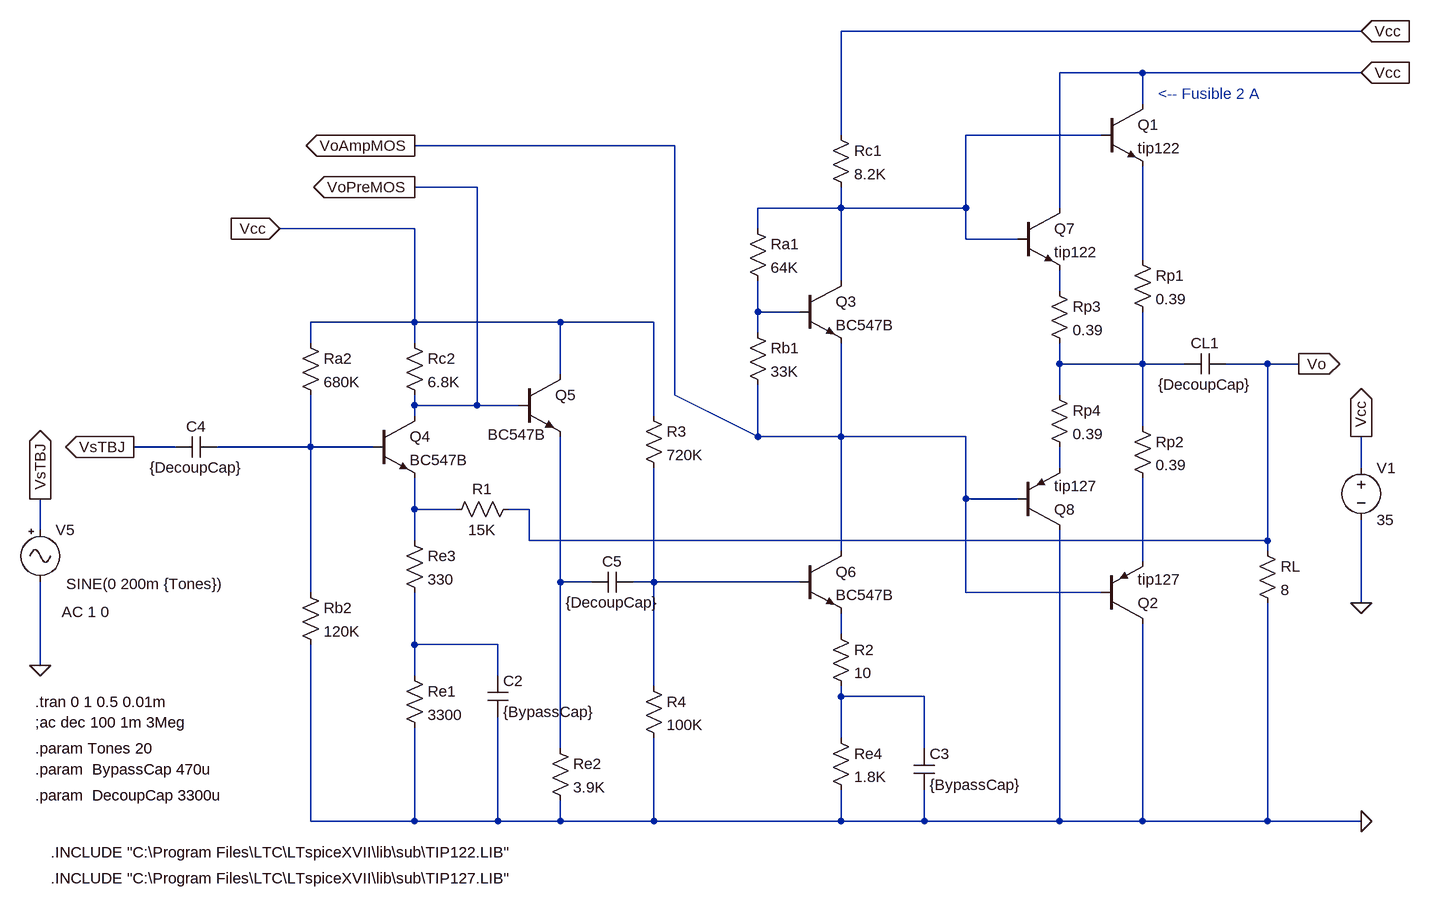
[diagram p0: schematic EA2-ProyectoFinal-AmplificadorDeBajaPotencia_TBJ_Only.asc]
EA2-ProyectoFinal-AmplificadorDeBajaPotencia_TBJ_Only.asc, the LTspice schematic file:
Version 4
SHEET 1 2792 1104
WIRE -1152 -384 -1952 -384
WIRE -1488 -320 -1616 -320
WIRE -1152 -320 -1488 -320
WIRE -1488 -272 -1488 -320
WIRE -1952 -224 -1952 -384
WIRE -1552 -224 -1760 -224
WIRE -2208 -208 -2608 -208
WIRE -2512 -144 -2608 -144
WIRE -1952 -112 -1952 -144
WIRE -1952 -112 -2080 -112
WIRE -1760 -112 -1760 -224
WIRE -1760 -112 -1952 -112
WIRE -1616 -112 -1616 -320
WIRE -2608 -80 -2816 -80
WIRE -2080 -80 -2080 -112
WIRE -1760 -64 -1760 -112
WIRE -1680 -64 -1760 -64
WIRE -1488 -32 -1488 -176
WIRE -1952 0 -1952 -112
WIRE -1616 16 -1616 -16
WIRE -2080 48 -2080 0
WIRE -2016 48 -2080 48
WIRE -2608 64 -2608 -80
WIRE -2608 64 -2768 64
WIRE -2384 64 -2608 64
WIRE -2240 64 -2384 64
WIRE -2080 80 -2080 48
WIRE -2768 96 -2768 64
WIRE -2608 96 -2608 64
WIRE -1616 128 -1616 96
WIRE -1488 128 -1488 48
WIRE -1488 128 -1616 128
WIRE -1424 128 -1488 128
WIRE -1296 128 -1360 128
WIRE -1248 128 -1296 128
WIRE -2384 144 -2384 64
WIRE -2208 176 -2208 -208
WIRE -1616 176 -1616 128
WIRE -2608 192 -2608 176
WIRE -2512 192 -2512 -144
WIRE -2512 192 -2608 192
WIRE -2448 192 -2512 192
WIRE -2608 208 -2608 192
WIRE -2240 208 -2240 64
WIRE -1488 224 -1488 128
WIRE -2080 240 -2080 160
WIRE -2080 240 -2208 176
WIRE -1952 240 -1952 96
WIRE -1952 240 -2080 240
WIRE -1760 240 -1952 240
WIRE -2976 256 -3040 256
WIRE -2768 256 -2768 176
WIRE -2768 256 -2912 256
WIRE -2672 256 -2768 256
WIRE -1616 288 -1616 256
WIRE -1152 288 -1152 240
WIRE -1760 336 -1760 240
WIRE -1680 336 -1760 336
WIRE -2608 352 -2608 304
WIRE -2544 352 -2608 352
WIRE -2432 352 -2464 352
WIRE -3184 384 -3184 336
WIRE -2608 400 -2608 352
WIRE -2432 400 -2432 352
WIRE -1296 400 -1296 128
WIRE -1296 400 -2432 400
WIRE -1952 416 -1952 240
WIRE -1296 416 -1296 400
WIRE -1488 432 -1488 304
WIRE -2384 464 -2384 240
WIRE -2336 464 -2384 464
WIRE -2240 464 -2240 288
WIRE -2240 464 -2272 464
WIRE -2016 464 -2240 464
WIRE -2768 480 -2768 256
WIRE -1760 480 -1760 336
WIRE -1552 480 -1760 480
WIRE -1152 496 -1152 368
WIRE -1952 544 -1952 512
WIRE -2608 560 -2608 480
WIRE -2480 560 -2608 560
WIRE -3184 592 -3184 464
WIRE -2608 608 -2608 560
WIRE -2480 608 -2480 560
WIRE -2240 624 -2240 464
WIRE -1952 640 -1952 624
WIRE -1824 640 -1952 640
WIRE -1952 704 -1952 640
WIRE -2384 720 -2384 464
WIRE -1824 720 -1824 640
WIRE -2768 832 -2768 560
WIRE -2608 832 -2608 688
WIRE -2608 832 -2768 832
WIRE -2480 832 -2480 672
WIRE -2480 832 -2608 832
WIRE -2384 832 -2384 800
WIRE -2384 832 -2480 832
WIRE -2240 832 -2240 704
WIRE -2240 832 -2384 832
WIRE -1952 832 -1952 784
WIRE -1952 832 -2240 832
WIRE -1824 832 -1824 784
WIRE -1824 832 -1952 832
WIRE -1616 832 -1616 384
WIRE -1616 832 -1824 832
WIRE -1488 832 -1488 528
WIRE -1488 832 -1616 832
WIRE -1296 832 -1296 496
WIRE -1296 832 -1488 832
WIRE -1152 832 -1296 832
FLAG -1152 -320 Vcc
IOPIN -1152 -320 In
FLAG -1248 128 Vo
IOPIN -1248 128 Out
FLAG -1152 -384 Vcc
IOPIN -1152 -384 In
FLAG -1152 496 0
FLAG -1152 240 Vcc
IOPIN -1152 240 Out
FLAG -1152 832 0
FLAG -3040 256 VsTBJ
IOPIN -3040 256 Out
FLAG -3184 336 VsTBJ
IOPIN -3184 336 Out
FLAG -3184 592 0
FLAG -2816 -80 Vcc
IOPIN -2816 -80 In
FLAG -2608 -144 VoPreMOS
IOPIN -2608 -144 Out
FLAG -2608 -208 VoAmpMOS
IOPIN -2608 -208 Out
SYMBOL res -1312 400 R0
SYMATTR InstName RL
SYMATTR Value 8
SYMBOL cap -1360 112 R90
WINDOW 0 0 32 VBottom 2
WINDOW 3 32 32 VTop 2
SYMATTR InstName CL1
SYMATTR Value {DecoupCap}
SYMBOL npn -1552 -272 R0
SYMATTR InstName Q1
SYMATTR Value tip122
SYMATTR Prefix X
SYMBOL pnp -1552 528 M180
SYMATTR InstName Q2
SYMATTR Value tip127
SYMATTR Prefix X
SYMBOL res -1504 -48 R0
SYMATTR InstName Rp1
SYMATTR Value 0.39
SYMBOL res -1504 208 R0
SYMATTR InstName Rp2
SYMATTR Value 0.39
SYMBOL voltage -1152 272 R0
SYMATTR InstName V1
SYMATTR Value 35
SYMBOL cap -2912 240 R90
WINDOW 0 0 32 VBottom 2
WINDOW 3 32 32 VTop 2
SYMATTR InstName C4
SYMATTR Value {DecoupCap}
SYMBOL Misc\\signal -3184 368 R0
WINDOW 3 40 99 Left 2
WINDOW 123 33 142 Left 2
WINDOW 39 0 0 Left 0
SYMATTR Value SINE(0 200m {Tones})
SYMATTR Value2 AC 1 0
SYMATTR InstName V5
SYMBOL res -1968 -240 R0
SYMATTR InstName Rc1
SYMATTR Value 8.2K
SYMBOL res -2096 -96 R0
SYMATTR InstName Ra1
SYMATTR Value 64K
SYMBOL res -2096 64 R0
SYMATTR InstName Rb1
SYMATTR Value 33K
SYMBOL npn -2016 0 R0
SYMATTR InstName Q3
SYMATTR Value BC547B
SYMBOL npn -2672 208 R0
SYMATTR InstName Q4
SYMATTR Value BC547B
SYMBOL res -2624 592 R0
SYMATTR InstName Re1
SYMATTR Value 3300
SYMBOL res -2624 80 R0
SYMATTR InstName Rc2
SYMATTR Value 6.8K
SYMBOL res -2784 80 R0
SYMATTR InstName Ra2
SYMATTR Value 680K
SYMBOL res -2784 464 R0
SYMATTR InstName Rb2
SYMATTR Value 120K
SYMBOL npn -2448 144 R0
WINDOW 3 -48 93 Left 2
SYMATTR Value BC547B
SYMATTR InstName Q5
SYMBOL res -2400 704 R0
SYMATTR InstName Re2
SYMATTR Value 3.9K
SYMBOL cap -2496 608 R0
SYMATTR InstName C2
SYMATTR Value {BypassCap}
SYMBOL res -2624 384 R0
SYMATTR InstName Re3
SYMATTR Value 330
SYMBOL npn -2016 416 R0
SYMATTR InstName Q6
SYMATTR Value BC547B
SYMBOL res -1968 688 R0
SYMATTR InstName Re4
SYMATTR Value 1.8K
SYMBOL res -2448 336 R90
WINDOW 0 0 56 VBottom 2
WINDOW 3 32 56 VTop 2
SYMATTR InstName R1
SYMATTR Value 15K
SYMBOL cap -1840 720 R0
SYMATTR InstName C3
SYMATTR Value {BypassCap}
SYMBOL res -1968 528 R0
SYMATTR InstName R2
SYMATTR Value 10
SYMBOL res -2256 192 R0
SYMATTR InstName R3
SYMATTR Value 720K
SYMBOL res -2256 608 R0
SYMATTR InstName R4
SYMATTR Value 100K
SYMBOL cap -2272 448 R90
WINDOW 0 0 32 VBottom 2
WINDOW 3 32 32 VTop 2
SYMATTR InstName C5
SYMATTR Value {DecoupCap}
SYMBOL npn -1680 -112 R0
SYMATTR InstName Q7
SYMATTR Value tip122
SYMATTR Prefix X
SYMBOL pnp -1680 384 M180
SYMATTR InstName Q8
SYMATTR Value tip127
SYMATTR Prefix X
SYMBOL res -1632 0 R0
SYMATTR InstName Rp3
SYMATTR Value 0.39
SYMBOL res -1632 160 R0
SYMATTR InstName Rp4
SYMATTR Value 0.39
TEXT -3168 880 Left 2 !.INCLUDE "C:\\Program Files\\LTC\\LTspiceXVII\\lib\\sub\\TIP122.LIB"
TEXT -3168 920 Left 2 !.INCLUDE "C:\\Program Files\\LTC\\LTspiceXVII\\lib\\sub\\TIP127.LIB"
TEXT -1464 -288 Left 2 ;<-- Fusible 2 A
TEXT -3192 648 Left 2 !.tran 0 1 0.5 0.01m
TEXT -3192 680 Left 2 !;ac dec 100 1m 3Meg
TEXT -3192 720 Left 2 !.param Tones 20
TEXT -3192 752 Left 2 !.param  BypassCap 470u
TEXT -3192 792 Left 2 !.param  DecoupCap 3300u

The netlist it stands for:
* EA2-ProyectoFinal-AmplificadorDeBajaPotencia_TBJ_Only.asc
RL Vo 0 8
CL1 Vo N005 {DecoupCap}
XQ1 Vcc N001 N002 tip122  ; pins C B E
XQ2 0 VoAmpMOS N009 tip127  ; pins C B E
Rp1 N002 N005 0.39
Rp2 N005 N009 0.39
V1 Vcc 0 35
C4 N006 VsTBJ {DecoupCap}
V5 VsTBJ 0 SINE(0 200m {Tones}) AC 1 0
Rc1 Vcc N001 8.2K
Ra1 N001 N004 64K
Rb1 N004 VoAmpMOS 33K
Q3 N001 N004 VoAmpMOS 0 BC547B
Q4 VoPreMOS N006 N008 0 BC547B
Re1 N013 0 3300
Rc2 Vcc VoPreMOS 6.8K
Ra2 Vcc N006 680K
Rb2 N006 0 120K
Q5 Vcc VoPreMOS N010 0 BC547B
Re2 N010 0 3.9K
C2 N013 0 {BypassCap}
Re3 N008 N013 330
Q6 VoAmpMOS N011 N012 0 BC547B
Re4 N014 0 1.8K
R1 Vo N008 15K
C3 N014 0 {BypassCap}
R2 N012 N014 10
R3 Vcc N011 720K
R4 N011 0 100K
C5 N011 N010 {DecoupCap}
XQ7 Vcc N001 N003 tip122  ; pins C B E
XQ8 0 VoAmpMOS N007 tip127  ; pins C B E
Rp3 N003 N005 0.39
Rp4 N005 N007 0.39
.model NPN NPN
.model PNP PNP
.lib standard.bjt
.INCLUDE "C:\Program Files\LTC\LTspiceXVII\lib\sub\TIP122.LIB"
.INCLUDE "C:\Program Files\LTC\LTspiceXVII\lib\sub\TIP127.LIB"
* <-- Fusible 2 A
.tran 0 1 0.5 0.01m
;ac dec 100 1m 3Meg
.param Tones 20
.param  BypassCap 470u
.param  DecoupCap 3300u
.backanno
.end